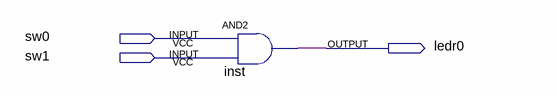
[diagram p0: schematic sheet]
// Quartus schematic and2_in.bdf as structural Verilog: 1 symbols, 3 pins
module and2_in (
  input  sw0,
  input  sw1,
  output ledr0
);

  and inst (ledr0, sw0, sw1);
endmodule
